# Altium schematic sheet Digital Receiver.SchDoc
size 406 x 304 mm; SheetNumber: 6; SheetTotal: 6
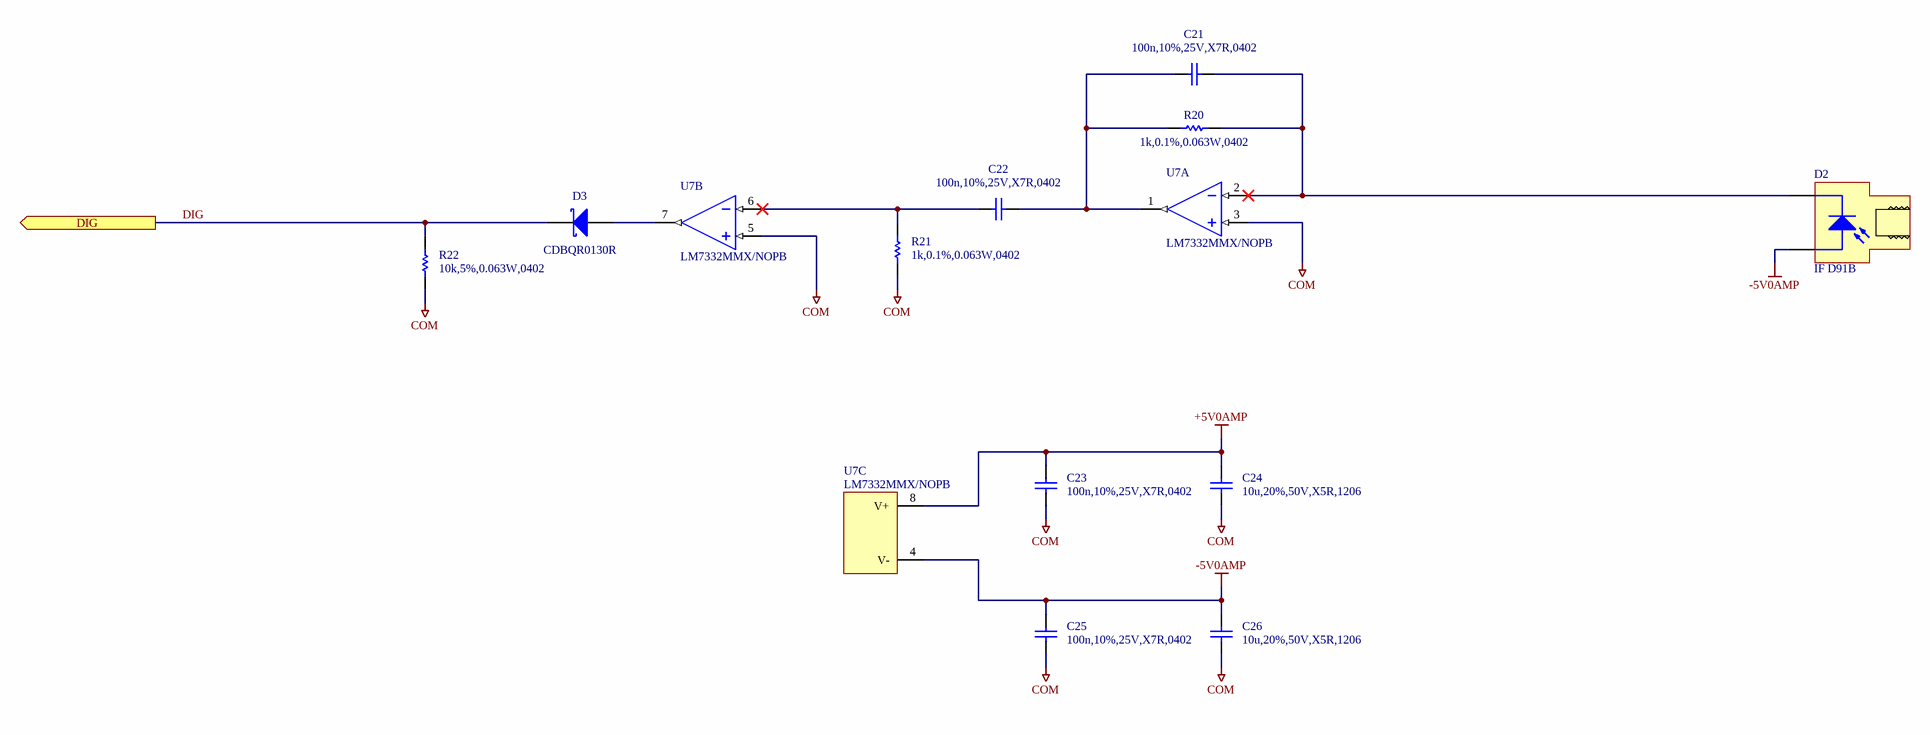
[diagram p0: Digital Receiver.SchDoc]

## Parts
C21  100n,10%,25V,X7R,0402  [CAPC1005X06N]
C22  100n,10%,25V,X7R,0402  [CAPC1005X06N]
C23  100n,10%,25V,X7R,0402  [CAPC1005X06N]
C24  10u,20%,50V,X5R,1206  [CAPC3216X16N]
C25  100n,10%,25V,X7R,0402  [CAPC1005X06N]
C26  10u,20%,50V,X5R,1206  [CAPC3216X16N]
D2  IF D91B  [INDUSTRIALFIBEROPTICS_IF-D91B]
D3  CDBQR0130R  [DFN65P100X50-2N]
R20  1k,0.1%,0.063W,0402  [RESC1005X04N]
R21  1k,0.1%,0.063W,0402  [RESC1005X04N]
R22  10k,5%,0.063W,0402  [RESC1005X04N]
U7  LM7332MMX/NOPB  [TEXASINSTRUMENTS_PKG_DGK0008A]  (parts A,B,C of 3)

## Ports
DIG (out)

## Nets
+5V0AMP: C23.2 C24.2 U7.8(V+)
-5V0AMP: C25.2 C26.2 D2.1(A) U7.4(V-)
COM: C23.1 C24.1 C25.1 C26.1 R21.1 R22.2 U7.3(INA+) U7.5(INB+)
DIG: D3.1(K) R22.1 ; port DIG
NetC21_1: C21.1 D2.2(K) R20.2 U7.2(INA-)
NetC21_2: C21.2 C22.1 R20.1 U7.1(OUTA)
NetC22_2: C22.2 R21.2 U7.6(INB-)
NetD3_2: D3.2(A) U7.7(OUTB)

## Notes on the sheet
- Rev
- Sheet Name:
- Date:
- Sheet
- Designer:
- of

## Library data of the parts
C21-C23 C25 = CAP,Cer,100nF,10%,25V,X7R,0402: 0.1ï¿½F ï¿½10% 25V Ceramic Capacitor X7R 0402 (1005 Metric); Manufacturer 1: Murata Electronics; Manufacturer 1 Part Number: GRM155R71E104KE14J; Vendor 1 Part Number: 490-14603-1-ND; Vendor 1: DigiKey; Value: 100nF; Part Name: CAP,Cer,100nF,10%,25V,X7R,0402; CreatedBy: Judd Foster; HelpURL: https://search.murata.co.jp/Ceramy/image/img/A01X/G101/ENG/GRM155R71E104KE14-01.pdf
C24 C26 = CAP,Cer,10uF,50VDC,X5R,1206: 10ï¿½F ï¿½20% 50V Ceramic Capacitor X5R 1206 (3216 Metric); Manufacturer 1: Samsung Electro-Mechanics; Manufacturer 1 Part Number: CL31A106MBHNNNE; Vendor 1 Part Number: 1276-6736-1-ND; Vendor 1: Digikey; Part Name: CAP,Cer,10uF,50VDC,X5R,1206; CreatedBy: Judd Foster; HelpURL: https://www.samsungsem.com/resources/file/global/support/product_catalog/MLCC.pdf; Value: 10u
D2 = RECEIVER,FIBER OPTIC,450-1050NM,IF-D91B: Fiber Optic Receiver General Purpose 100Mbps; Manufacturer 1: Industrial Fiber Optics; Vendor 1 Part Number: FB200-ND; Vendor 1: DigiKey; Part Name: RECEIVER,FIBER OPTIC,450-1050NM,IF-D91B; CreatedBy: Judd Foster; HelpURL: https://i-fiberoptics.com/pdf/ifd91b-1809.pdf; Manufacturer 1 Part Number: IF D91B
D3 = DIODE,Schottky,30V,100mA,SMD: Diode 30 V 100mA Surface Mount 0402C/SOD-923F; Manufacturer 1: Comchip Technology; Vendor 1 Part Number: 641-1272-1-ND; Vendor 1: Digikey; Part Name: DIODE,Schottky,30V,100mA,SMD; CreatedBy: Judd Foster; HelpURL: https://mm.digikey.com/Volume0/opasdata/d220001/medias/docus/3209/CDBQR0130R.pdf; Manufacturer 1 Part Number: CDBQR0130R
R20 R21 = RES,1k,0.1%,0.063W,0402: 1 kOhms Â±0.1% 0.063W, 1/16W Chip Resistor 0402 (1005 Metric) Thin Film; Manufacturer 1: YAGEO; Manufacturer 1 Part Number: RT0402BRE071KL; Vendor 1 Part Number: YAG2306CT-ND; Vendor 1: DigiKey; Part Name: RES,1k,0.1%,0.063W,0402; CreatedBy: Judd Foster; HelpURL: https://www.yageo.com/upload/media/product/app/datasheet/rchip/pyu-rt_1-to-0.01_rohs_l.pdf; Value: 1k
R22 = RES,10k,5%,0.063W,0402: 10 kOhms ï¿½5% 0.063W, 1/16W Chip Resistor 0402 (1005 Metric) Automotive AEC-Q200 Thick Film; Manufacturer 1: Stackpole Electronics Inc; Manufacturer 1 Part Number: RMCF0402JT10K0; Vendor 1 Part Number: RMCF0402JT10K0CT-ND; Vendor 1: DIgikey; Part Name: RES,10k,5%,0.063W,0402; CreatedBy: Judd Foster; HelpURL: https://www.seielect.com/catalog/sei-rmcf_rmcp.pdf; Value: 10k
U7 = LM7332MMX_NOPB: General Purpose Amplifier 2 Circuit Rail-to-Rail 8-VSSOP; Manufacturer 1: Texas Instruments; Vendor 1 Part Number: 296-LM7332MMX/NOPBCT-ND; Vendor 1: DigiKey; Part Name: LM7332MMX_NOPB; CreatedBy: Judd Foster; HelpURL: https://www.ti.com/lit/ds/symlink/lm7332.pdf?HQS=dis-dk-null-digikeymode-dsf-pf-null-wwe&ts=1730932081789&ref_url=https%253A%252F%252Fwww.ti.com%252Fgeneral%252Fdocs%252Fsuppproductinfo.tsp%253FdistId%253D10%2526gotoUrl%253Dhttps%253A%252F%252Fwww.ti.com%; Manufacturer 1 Part Number: LM7332MMX/NOPB